# Altium project DataLogger_XIAO.PrjPcb
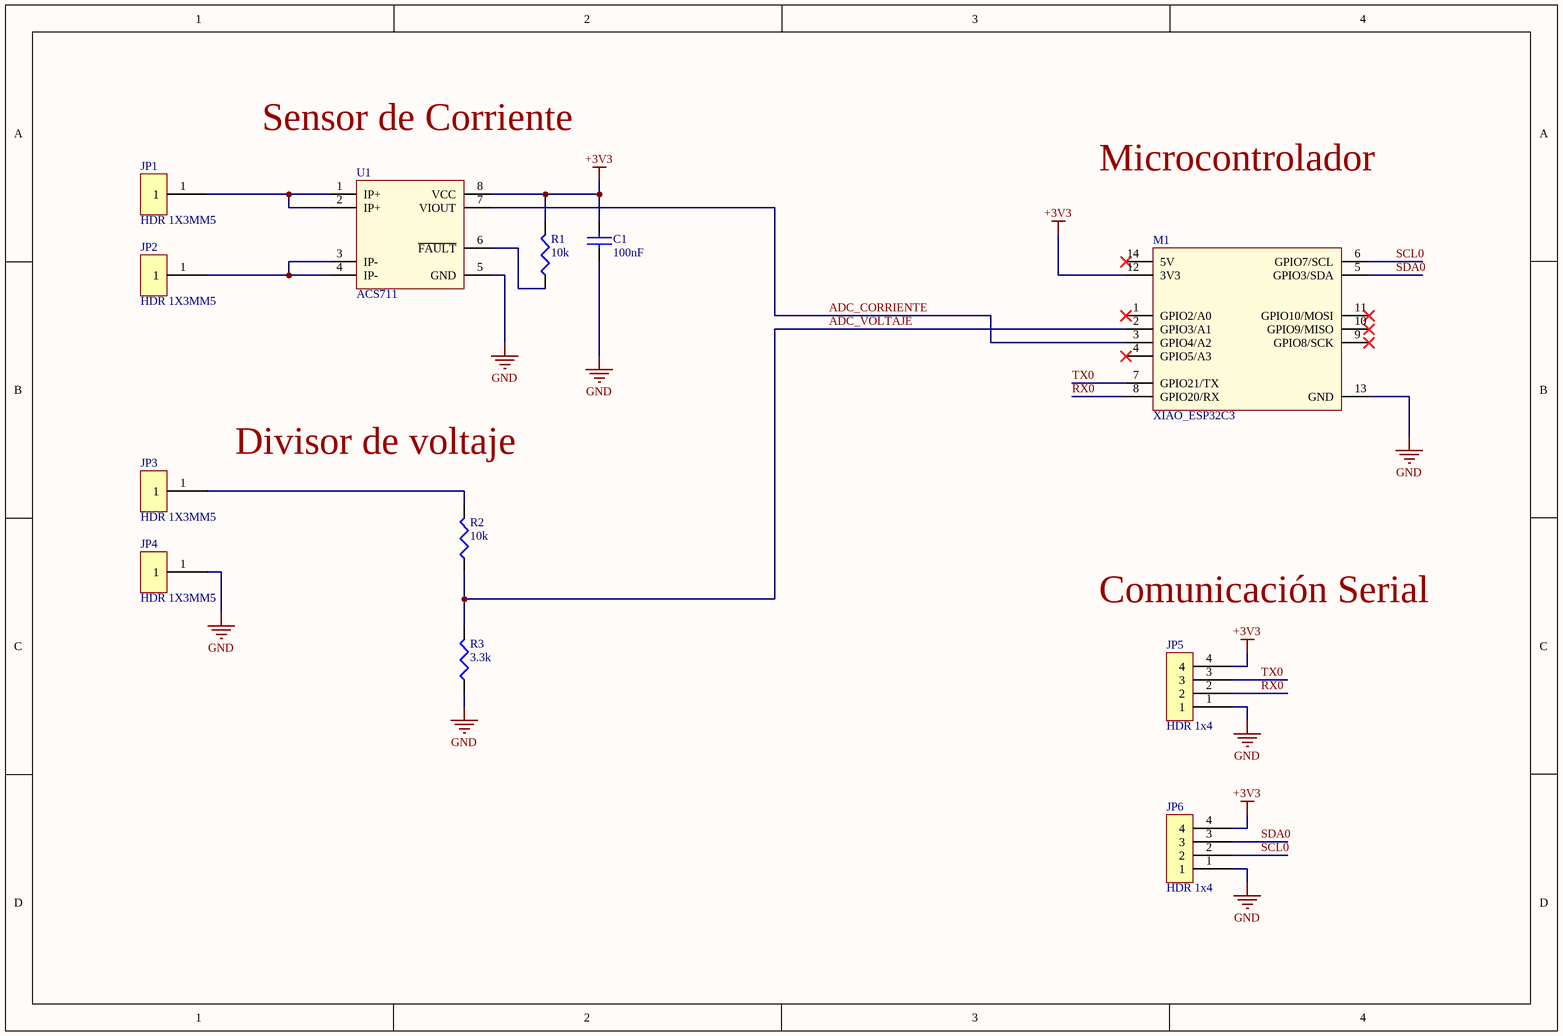
[diagram p0: DataLogger_XIAO.SchDoc]
1 sheet, 12 parts. Net scope: global (net labels, ports and power ports of the same name join across sheets).
Board file: DataLogger_XIAO.PcbDoc

## Sheet DataLogger_XIAO.SchDoc
size A4; SheetNumber: 1; SheetTotal: 1

### Parts
C1  100nF  [c0603]
JP1  HDR 1X3MM5  [TERMINAL 1X3.55]
JP2  HDR 1X3MM5  [TERMINAL 1X3.55]
JP3  HDR 1X3MM5  [TERMINAL 1X3.55]
JP4  HDR 1X3MM5  [TERMINAL 1X3.55]
JP5  HDR 1x4  [Hdr_1x4_2.54MM]
JP6  HDR 1x4  [Hdr_1x4_2.54MM]
M1  XIAO_ESP32C3  [MODULE_XIAO_ESP32C3]
R1  10k  [R0603]
R2  10k  [R0603]
R3  3.3k  [R0603]
U1  ACS711  [SOIC-8N-ACS711]

### Nets
+3V3: C1.1 JP5.4 JP6.4 M1.12(3V3) R1.2 U1.8(VCC)
GND: C1.2 JP4.1 JP5.1 JP6.1 M1.13(GND) R3.1 U1.5(GND)
ADC_CORRIENTE: M1.3(GPIO4/A2) U1.7(VIOUT)
ADC_VOLTAJE: M1.2(GPIO3/A1) R2.1 R3.2
RX0: JP5.2 M1.8(GPIO20/RX)
SCL0: JP6.2 M1.6(GPIO7/SCL)
SDA0: JP6.3 M1.5(GPIO3/SDA)
TX0: JP5.3 M1.7(GPIO21/TX)
NetJP1_1: JP1.1 U1.1(IP+) U1.2(IP+)
NetJP2_1: JP2.1 U1.3(IP-) U1.4(IP-)
NetJP3_1: JP3.1 R2.2
NetR1_1: R1.1 U1.6(~{FAULT})

Not connected (* = marked no-connect by the designer): M1 1(GPIO2/A0)* 4(GPIO5/A3)* 9(GPIO8/SCK)* 10(GPIO9/MISO)* 11(GPIO10/MOSI)* 14(5V)*

### Notes on the sheet
- Sensor de Corriente
- Microcontrolador
- Divisor de voltaje
- Comunicación Serial

### Library data of the parts
C1 = 06035C104K4Z4A: Multilayer Ceramic Capacitor, 0.1 uF, 50 V, ï¿½ 10%, X7R, 0603 [1608 Metric]; Manufacturer: Kyocera AVX; Voltage Rating: 50V; Supplier: Avnet; Supplier Part Number: 96Y8355; Manufacturer Part Number: 06035C104K4Z4A; RoHS: Yes; Category: Ceramic Capacitors; Stock: 4484; Pricing: 1=0.458, 25=0.314, 100=0.207, 250=0.184, 500=0.16 (USD); Case/Package: 0603; Case Code (Imperial): 0603; Case Code (Metric): 1608; Min Operating Temperature: -55°C; Max Operating Temperature: 125°C; Tolerance: 10%; Packaging: Tape and Reel; Value: 100nF; Package Quantity: 15000; Voltage Rating (DC): 50V; Dielectric: X7R; Termination: SMD/SMT; Features: Soft Termination; Series: FLEXITERM®; Length: 1.6mm; Width: 0.81mm; Height: 0.94mm; Ratings: AEC-Q200; Lead Free: Lead Free; RoHS Compliant: Yes; ComponentLink1URL: http://www.mouser.com/ds/2/40/AutoMLCC-777028.pdf?src-supplier=Mouser; ComponentLink1Description: http://www.mouser.com/ds/2/40/AutoMLCC-777028.pdf?src-supplier=Mouser; ComponentLink2URL: https://www.avx.com/docs/Catalogs/flexiterm.pdf?src-supplier=Avnet; ComponentLink2Description: https://www.avx.com/docs/Catalogs/flexiterm.pdf?src-supplier=Avnet; ComponentLink3URL: http://catalogs.avx.com/SurfaceMount.pdf?src-supplier=Digikey; ComponentLink3Description: http://catalogs.avx.com/SurfaceMount.pdf?src-supplier=Digikey; ComponentLink4URL: http://www.farnell.com/datasheets/2880953.pdf?src-supplier=Newark; ComponentLink4Description: http://www.farnell.com/datasheets/2880953.pdf?src-supplier=Newark; ComponentLink5URL: http://www.avx.com/docs/Catalogs/flexiterm.pdf?src-supplier=Future+Electronics; ComponentLink5Description: http://www.avx.com/docs/Catalogs/flexiterm.pdf?src-supplier=Future+Electronics; ComponentLink6URL: https://datasheet.octopart.com/06035C104K4Z4A-AVX-datasheet-50865111.pdf?src-supplier=Future+Electronics; ComponentLink6Description: https://datasheet.octopart.com/06035C104K4Z4A-AVX-datasheet-50865111.pdf?src-supplier=Future+Electronics; ComponentLink7URL: https://datasheet.octopart.com/06035C104K4Z4A-KYOCERA-AVX-datasheet-156093842.pdf?src-supplier=TME; ComponentLink7Description: https://datasheet.octopart.com/06035C104K4Z4A-KYOCERA-AVX-datasheet-156093842.pdf?src-supplier=TME
JP1-JP4 = PIN3MM5: BERGSTIK 3.5 MM; Manufacturer: FCI; Manufacturer Part Number: 68000-103HLF; Connector Type: Header, Unshrouded; Number of Positions: 3; Number of Positions Loaded: All; Pitch: 0.100" (2.54mm); .Checked PCB: used; Supplier 1: Digi-Key; RoHS: RoHS Compliant; Category: Connectors, Interconnects; Stock 1: 37214; Pricing 1: 1=0.15, 10=0.145, 25=0.108, 50=0.0924 (USD); Packaging: Bulk; Contact Type: Male Pin; Number of Rows: 1; Row Spacing: -; Contact Mating Length: 0.230" (5.84mm); Mounting Type: Through Hole; Termination: Solder; Fastening Type: -; Features: -; Contact Finish: Gold or Gold, GXT™; Contact Finish Thickness: 30µin (0.76µm); Color: Black; ComponentLink1URL: http://portal.fciconnect.com/Comergent//fci/drawing/68000.pdf; ComponentLink1Description: http://portal.fciconnect.com/Comergent//fci/drawing/68000.pdf; Supplier Part Number 1: 609-3461-ND; .Creator: MM; .Checked SCH: used
JP5 JP6 = 68000-104HLF: Conn Unshrouded Header HDR 4 POS 2.54mm Solder ST Top Entry Thru-Hole BergStik® Bulk; Manufacturer: Amphenol ICC; Supplier: Rs; Supplier Part Number: 8632771; Manufacturer Part Number: 68000-104HLF; RoHS: Yes
M1 = 113991054: Seeed Studio Xiao ESP32C3 Wifi+b; Supplier: Digikey; Supplier Part Number: 1597-113991054-ND; Manufacturer: Seeed Studio; Manufacturer Part Number: 113991054; RoHS: No; Category: Uncategorized; Stock: 3303; Pricing: 1=4.99 (USD)
R1-R3 = TP0603T10K0P0510Z: RES SMD 10K OHM 1% 1/8W 0603; Manufacturer: Yageo; Manufacturer Part Number: RC0805FR-0710KL; Power (Watts): 0.125W, 1/8W; Temperature Coefficient: ±100ppm/°C; .Creator: MM; .Checked PCB: RF; Supplier 1: Digi-Key; RoHS: RoHS Compliant; Category: Resistors; Stock 1: 4094384; Pricing 1: 1=0.1, 10=0.021, 25=0.0148, 100=0.0084, 250=0.0064, 500=0.0051, 1000=0.00376, 2500=0.00326 (USD); Packaging: Cut Tape (CT); Resistance (Ohms): 10k; Tolerance: ±1%; Composition: Thick Film; Features: Moisture Resistant; Operating Temperature: -55°C ~ 155°C; Package / Case: 0805 (2012 Metric); Supplier Device Package: 0805; Size / Dimension: 0.079" L x 0.049" W (2.00mm x 1.25mm); Height: 0.024" (0.60mm); Number of Terminations: 2; ComponentLink1URL: http://www.yageo.com/documents/recent/PYu-RC_Group_51_RoHS_L_1.pdf; ComponentLink1Description: http://www.yageo.com/documents/recent/PYu-RC_Group_51_RoHS_L_1.pdf; Supplier Part Number 1: 311-10.0KCRCT-ND; .Checked SCH: RF
U1 = ACS711ELCTR-25AB-T: SENSOR CURRENT HALL 25A AC/DC; Manufacturer: Allegro MicroSystems; Max Supply Current: 5.5mA; Number of Channels: 1; Frequency: 100kHz; Response Time: 4.6us; Linearity: 1%; Accuracy: 5%; Sensitivity: 55mV/A; Operating Supply Voltage: 3.3V; Supplier: Digikey; Supplier Part Number: 620-1371-1-ND; Manufacturer Part Number: ACS711ELCTR-25AB-T; RoHS: Yes; Category: Current Sensors; Stock: 6677; Pricing: 1=2, 5=1.75, 10=1.499, 25=1.4328, 50=1.2156, 100=1.1323 (USD); Case/Package: SOIC; Pins: 8; Min Operating Temperature: -40°C; Max Operating Temperature: 85°C; Package Quantity: 1; Packaging: Tape and Reel; Current Sensing: 25A; Series: -; -3db Bandwidth: 100kHz; RoHS Compliant: Yes; ComponentLink1URL: https://datasheet.ciiva.com/3277/acs711-datasheet-3277044.pdf?src-supplier=Avnet; ComponentLink1Description: https://datasheet.ciiva.com/3277/acs711-datasheet-3277044.pdf?src-supplier=Avnet